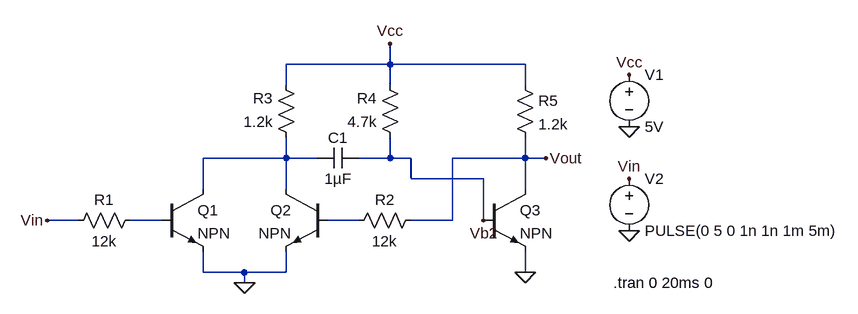
[diagram p0: schematic BJT Astable Multivibrator with 3bjt.asc]
BJT Astable Multivibrator with 3bjt.asc, the LTspice schematic file:
Version 4.1
SHEET 1 1124 680
WIRE 416 -48 416 -80
WIRE 416 -48 256 -48
WIRE 624 -48 416 -48
WIRE 256 -16 256 -48
WIRE 416 -16 416 -48
WIRE 624 -16 624 -48
WIRE 256 96 256 64
WIRE 256 96 128 96
WIRE 304 96 256 96
WIRE 416 96 416 64
WIRE 416 96 368 96
WIRE 448 96 416 96
WIRE 624 96 624 64
WIRE 624 96 512 96
WIRE 656 96 624 96
WIRE 448 128 448 96
WIRE 560 128 448 128
WIRE 128 144 128 96
WIRE 256 144 256 96
WIRE 624 144 624 96
WIRE -64 192 -112 192
WIRE 64 192 16 192
WIRE 368 192 320 192
WIRE 512 192 512 96
WIRE 512 192 448 192
WIRE 560 192 560 128
WIRE 128 272 128 240
WIRE 192 272 128 272
WIRE 256 272 256 240
WIRE 256 272 192 272
WIRE 624 272 624 240
WIRE 192 288 192 272
FLAG 192 288 0
FLAG 624 272 0
FLAG 784 48 0
FLAG 784 -32 Vcc
FLAG 416 -80 Vcc
FLAG 784 208 0
FLAG 784 128 Vin
FLAG -112 192 Vin
FLAG 656 96 Vout
FLAG 560 192 Vb2
SYMBOL npn 64 144 R0
SYMATTR InstName Q1
SYMBOL npn 320 144 M0
SYMATTR InstName Q2
SYMBOL res 32 176 R90
WINDOW 0 0 56 VBottom 2
WINDOW 3 32 56 VTop 2
SYMATTR InstName R1
SYMATTR Value 12k
SYMBOL res 464 176 R90
WINDOW 0 0 56 VBottom 2
WINDOW 3 32 56 VTop 2
SYMATTR InstName R2
SYMATTR Value 12k
SYMBOL res 272 80 R180
WINDOW 0 36 76 Left 2
WINDOW 3 36 40 Left 2
SYMATTR InstName R3
SYMATTR Value 1.2k
SYMBOL res 432 80 R180
WINDOW 0 36 76 Left 2
WINDOW 3 36 40 Left 2
SYMATTR InstName R4
SYMATTR Value 4.7k
SYMBOL cap 368 80 R90
WINDOW 0 0 32 VBottom 2
WINDOW 3 32 32 VTop 2
SYMATTR InstName C1
SYMATTR Value 1µF
SYMBOL res 608 -32 R0
SYMATTR InstName R5
SYMATTR Value 1.2k
SYMBOL npn 560 144 R0
SYMATTR InstName Q3
SYMBOL voltage 784 -48 R0
WINDOW 123 0 0 Left 0
WINDOW 39 0 0 Left 0
SYMATTR InstName V1
SYMATTR Value 5V
SYMBOL voltage 784 112 R0
WINDOW 123 0 0 Left 0
WINDOW 39 0 0 Left 0
SYMATTR InstName V2
SYMATTR Value PULSE(0 5 0 1n 1n 1m 5m)
TEXT 760 288 Left 2 !.tran 0 20ms 0

The netlist it stands for:
* BJT Astable Multivibrator with 3bjt.asc
Q1 N001 N002 0 0 NPN
Q2 N001 N003 0 0 NPN
R1 N002 Vin 12k
R2 Vout N003 12k
R3 N001 Vcc 1.2k
R4 Vb2 Vcc 4.7k
C1 Vb2 N001 1µF
R5 Vcc Vout 1.2k
Q3 Vout Vb2 0 0 NPN
V1 Vcc 0 5V
V2 Vin 0 PULSE(0 5 0 1n 1n 1m 5m)
.model NPN NPN
.model PNP PNP
.lib standard.bjt
.tran 0 20ms 0
.backanno
.end